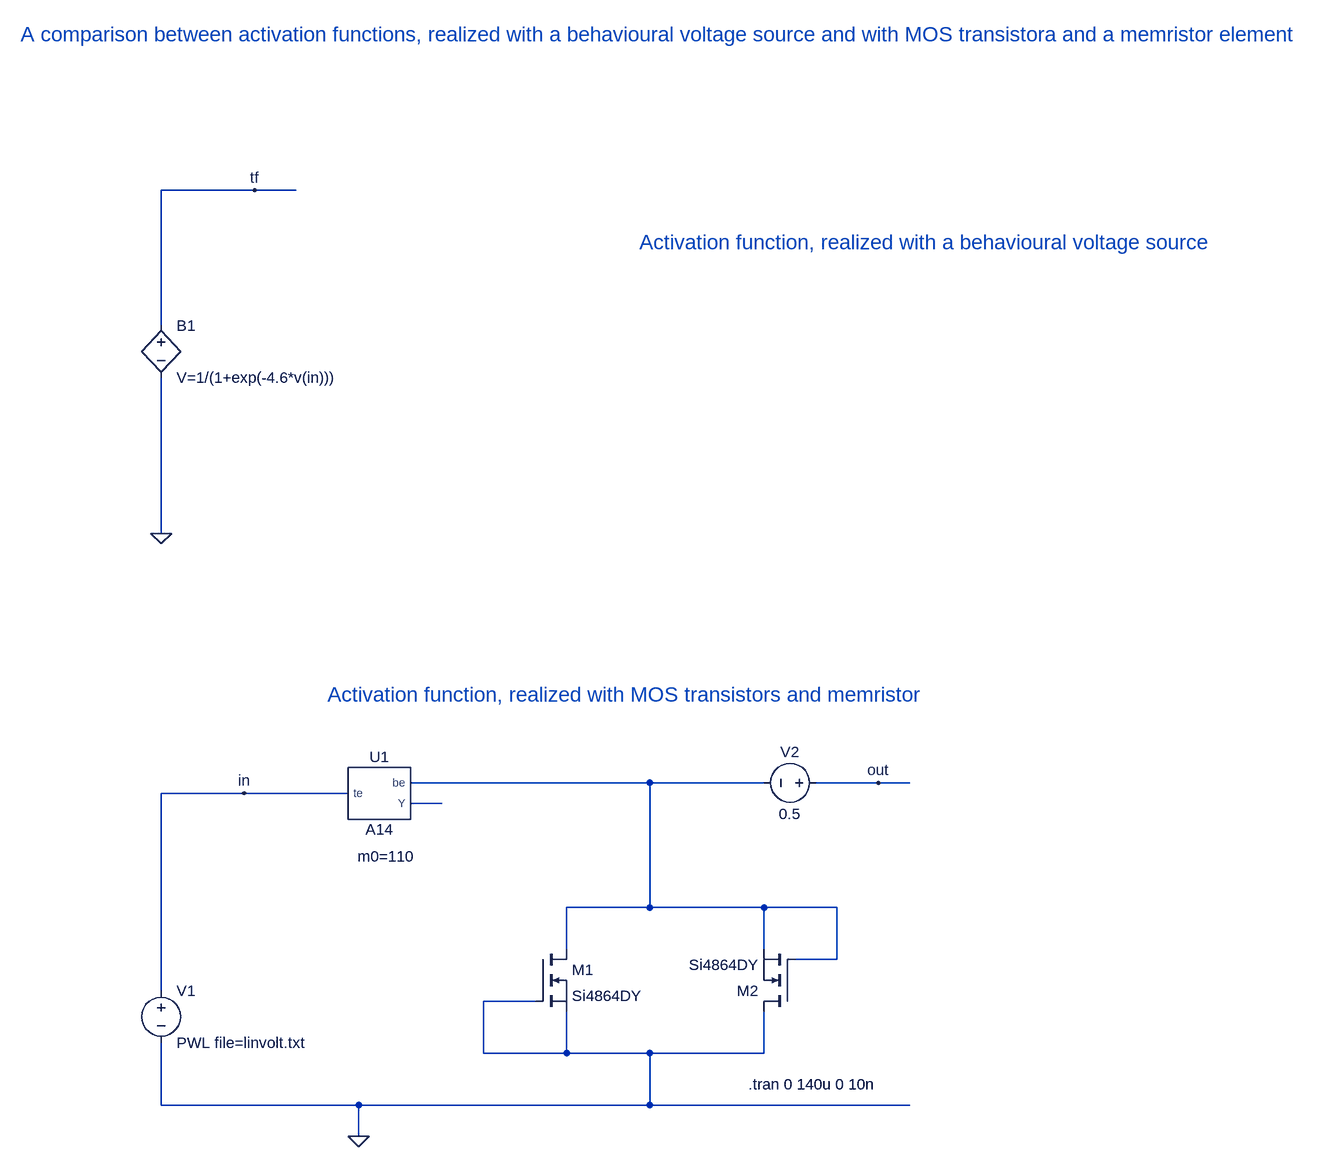
[diagram p0: schematic Draft1.asc]
Draft1.asc, the LTspice schematic file:
Version 4
SHEET 1 2208 680
WIRE 160 -896 16 -896
WIRE 224 -896 160 -896
WIRE 16 -688 16 -896
WIRE 16 -368 16 -608
WIRE 768 16 400 16
WIRE 944 16 768 16
WIRE 1120 16 1024 16
WIRE 1168 16 1120 16
WIRE 144 32 16 32
WIRE 304 32 144 32
WIRE 448 48 400 48
WIRE 768 208 768 16
WIRE 768 208 640 208
WIRE 944 208 768 208
WIRE 1056 208 944 208
WIRE 640 272 640 208
WIRE 944 272 944 208
WIRE 1056 288 1056 208
WIRE 1056 288 992 288
WIRE 16 336 16 32
WIRE 592 352 512 352
WIRE 512 432 512 352
WIRE 640 432 640 368
WIRE 640 432 512 432
WIRE 768 432 640 432
WIRE 944 432 944 368
WIRE 944 432 768 432
WIRE 16 512 16 416
WIRE 320 512 16 512
WIRE 768 512 768 432
WIRE 768 512 320 512
WIRE 1168 512 768 512
WIRE 320 560 320 512
FLAG 320 560 0
FLAG 144 32 in
FLAG 1120 16 out
FLAG 16 -368 0
FLAG 160 -896 tf
SYMBOL voltage 16 320 R0
WINDOW 123 0 0 Left 0
WINDOW 39 0 0 Left 0
SYMATTR InstName V1
SYMATTR Value PWL file=linvolt.txt
SYMBOL AutoGenerated\\A14 352 32 R0
WINDOW 39 11 113 Bottom 2
SYMATTR SpiceLine m0=110
SYMATTR InstName U1
SYMBOL voltage 1040 16 R90
WINDOW 0 -32 56 VBottom 2
WINDOW 3 32 56 VTop 2
WINDOW 123 0 0 Left 0
WINDOW 39 0 0 Left 0
SYMATTR InstName V2
SYMATTR Value 0.5
SYMBOL bv 16 -704 R0
SYMATTR InstName B1
SYMATTR Value V=1/(1+exp(-4.6*v(in)))
SYMBOL nmos 592 272 R0
SYMATTR InstName M1
SYMATTR Value Si4864DY
SYMBOL nmos 992 368 R180
SYMATTR InstName M2
SYMATTR Value Si4864DY
TEXT 920 480 Left 2 !.tran 0 140u 0 10n
TEXT -200 -1136 Left 3 ;A comparison between activation functions, realized with a behavioural voltage source and with MOS transistora and a memristor element
TEXT 752 -816 Left 3 ;Activation function, realized with a behavioural voltage source
TEXT 272 -120 Left 3 ;Activation function, realized with MOS transistors and memristor

The netlist it stands for:
* Draft1.asc
V1 in 0 PWL file=linvolt.txt
XU1 in N001 N002 A14 m0=110  ; pins te be Y
V2 out N001 0.5
B1 tf 0 V=1/(1+exp(-4.6*v(in)))
M1 N001 0 0 0 Si4864DY
M2 0 N001 N001 N001 Si4864DY
.model NMOS NMOS
.model PMOS PMOS
.lib standard.mos
.tran 0 140u 0 10n
* A comparison between activation functions, realized with a behavioural voltage source and with MOS transistora and a memristor element
* Activation function, realized with a behavioural voltage source
* Activation function, realized with MOS transistors and memristor
.lib D:\LTSPICE library not erase\A14.txt
.backanno
.end